# EAGLE design Spectroscilloscope Revised_7 (EAGLE 9.6.2)
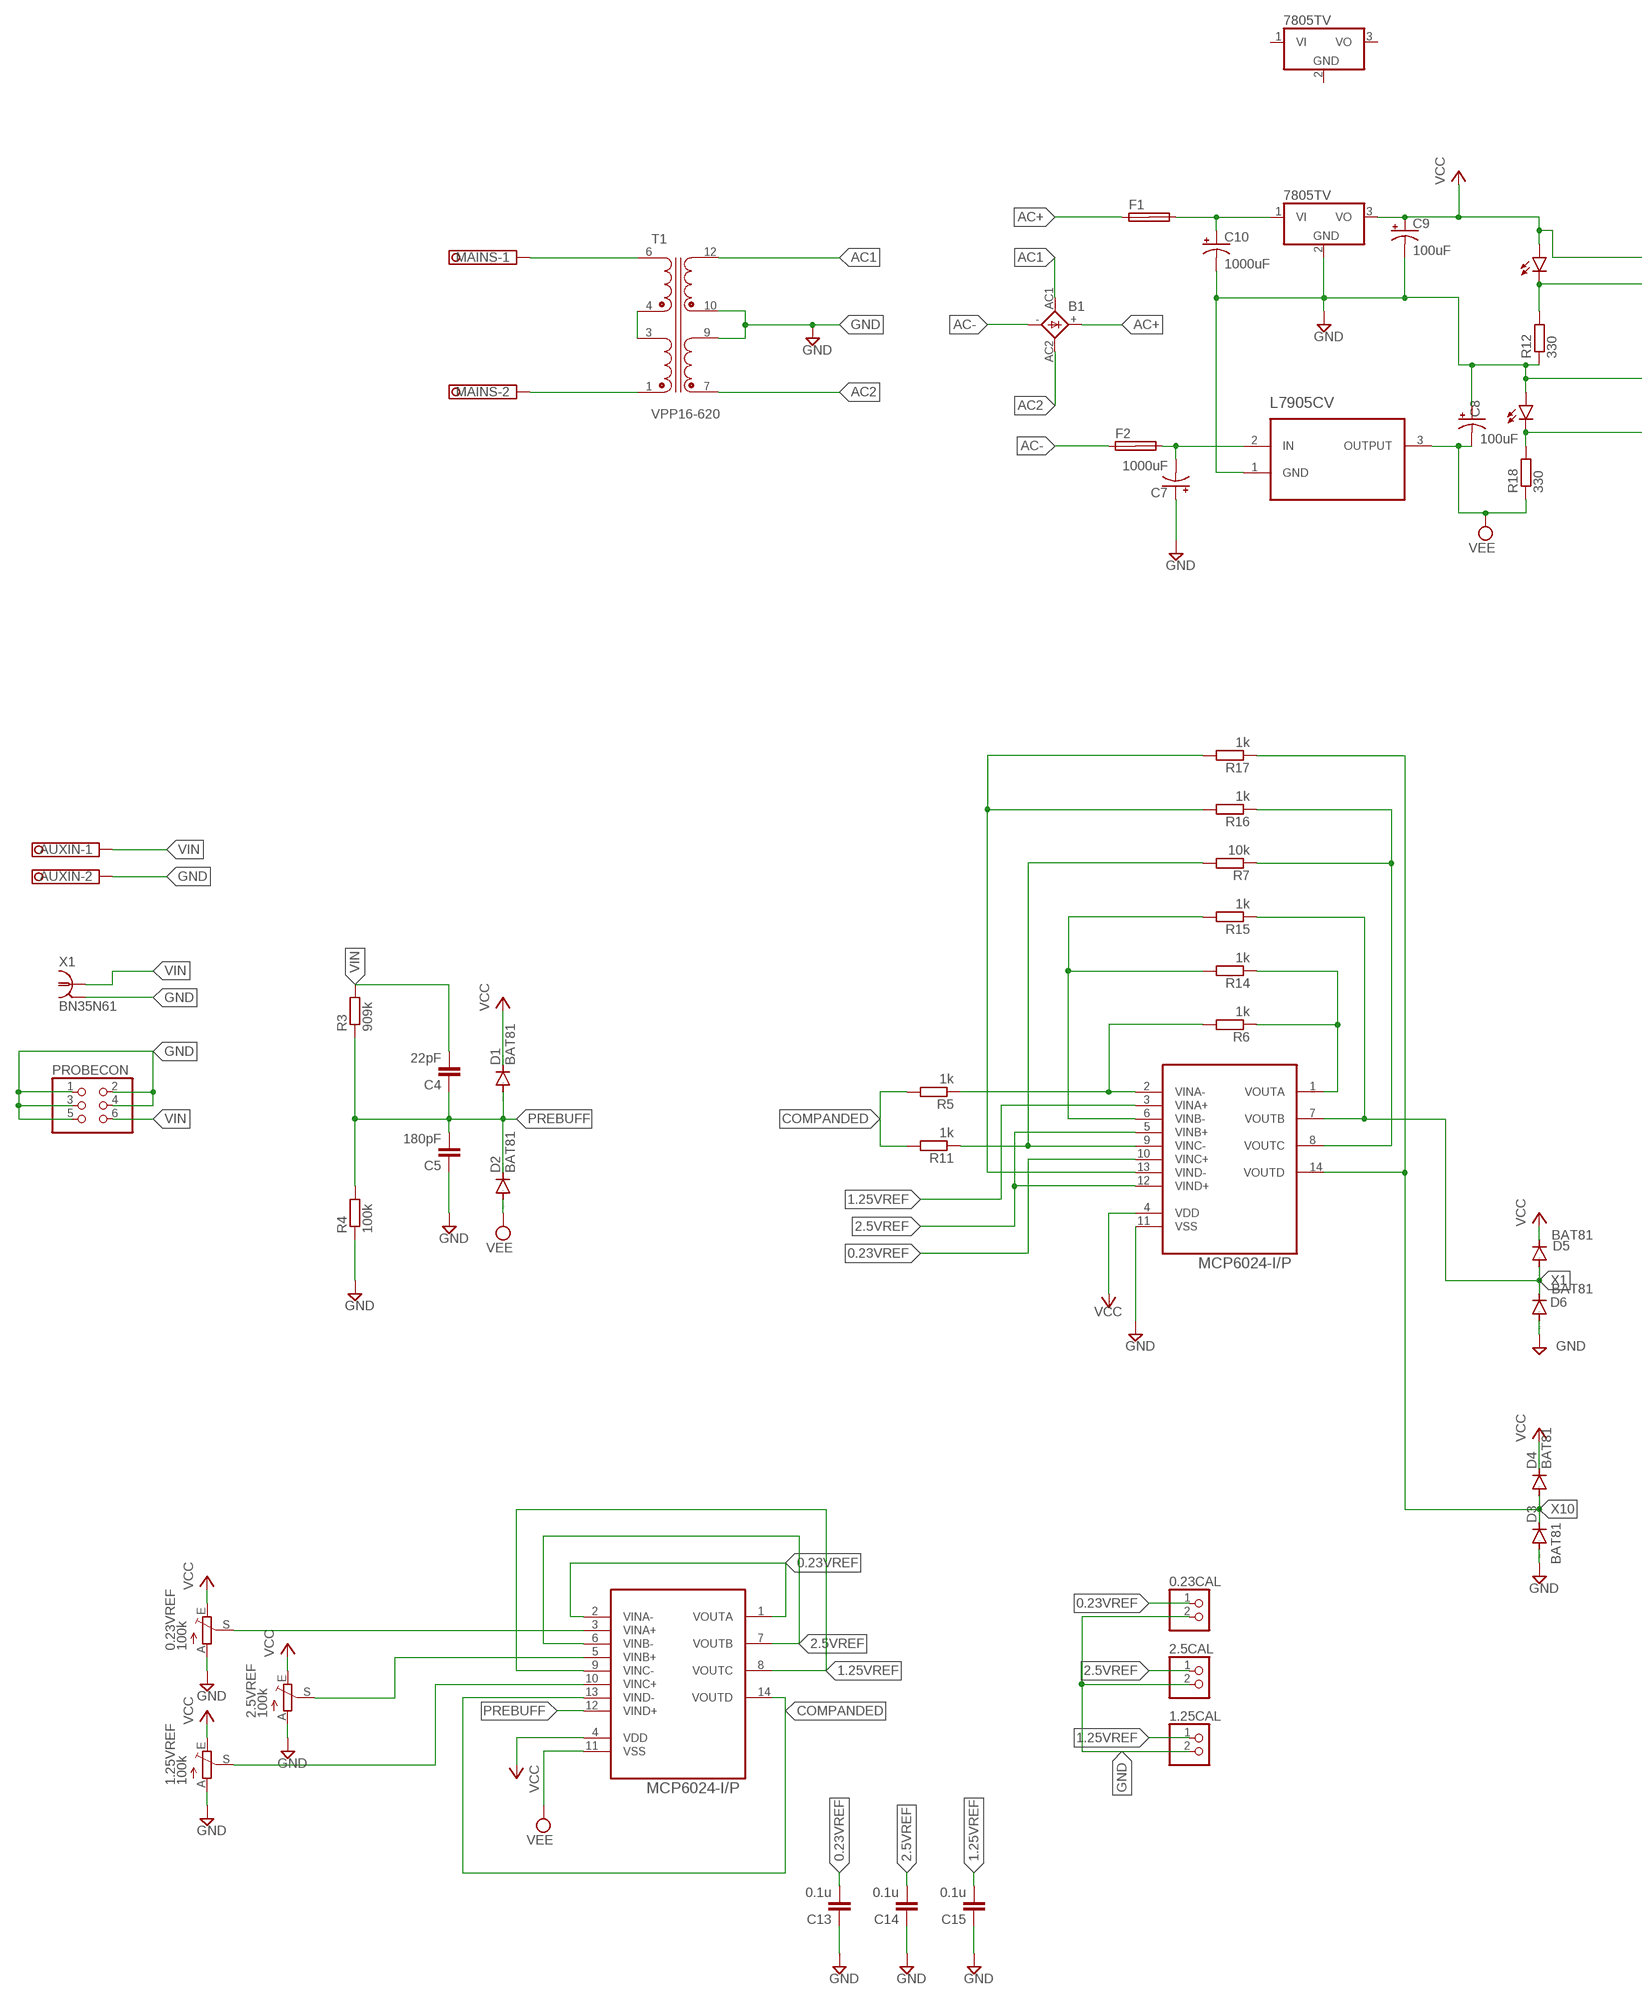
[diagram p0: schematic, sheet 1, part 1 of 2]
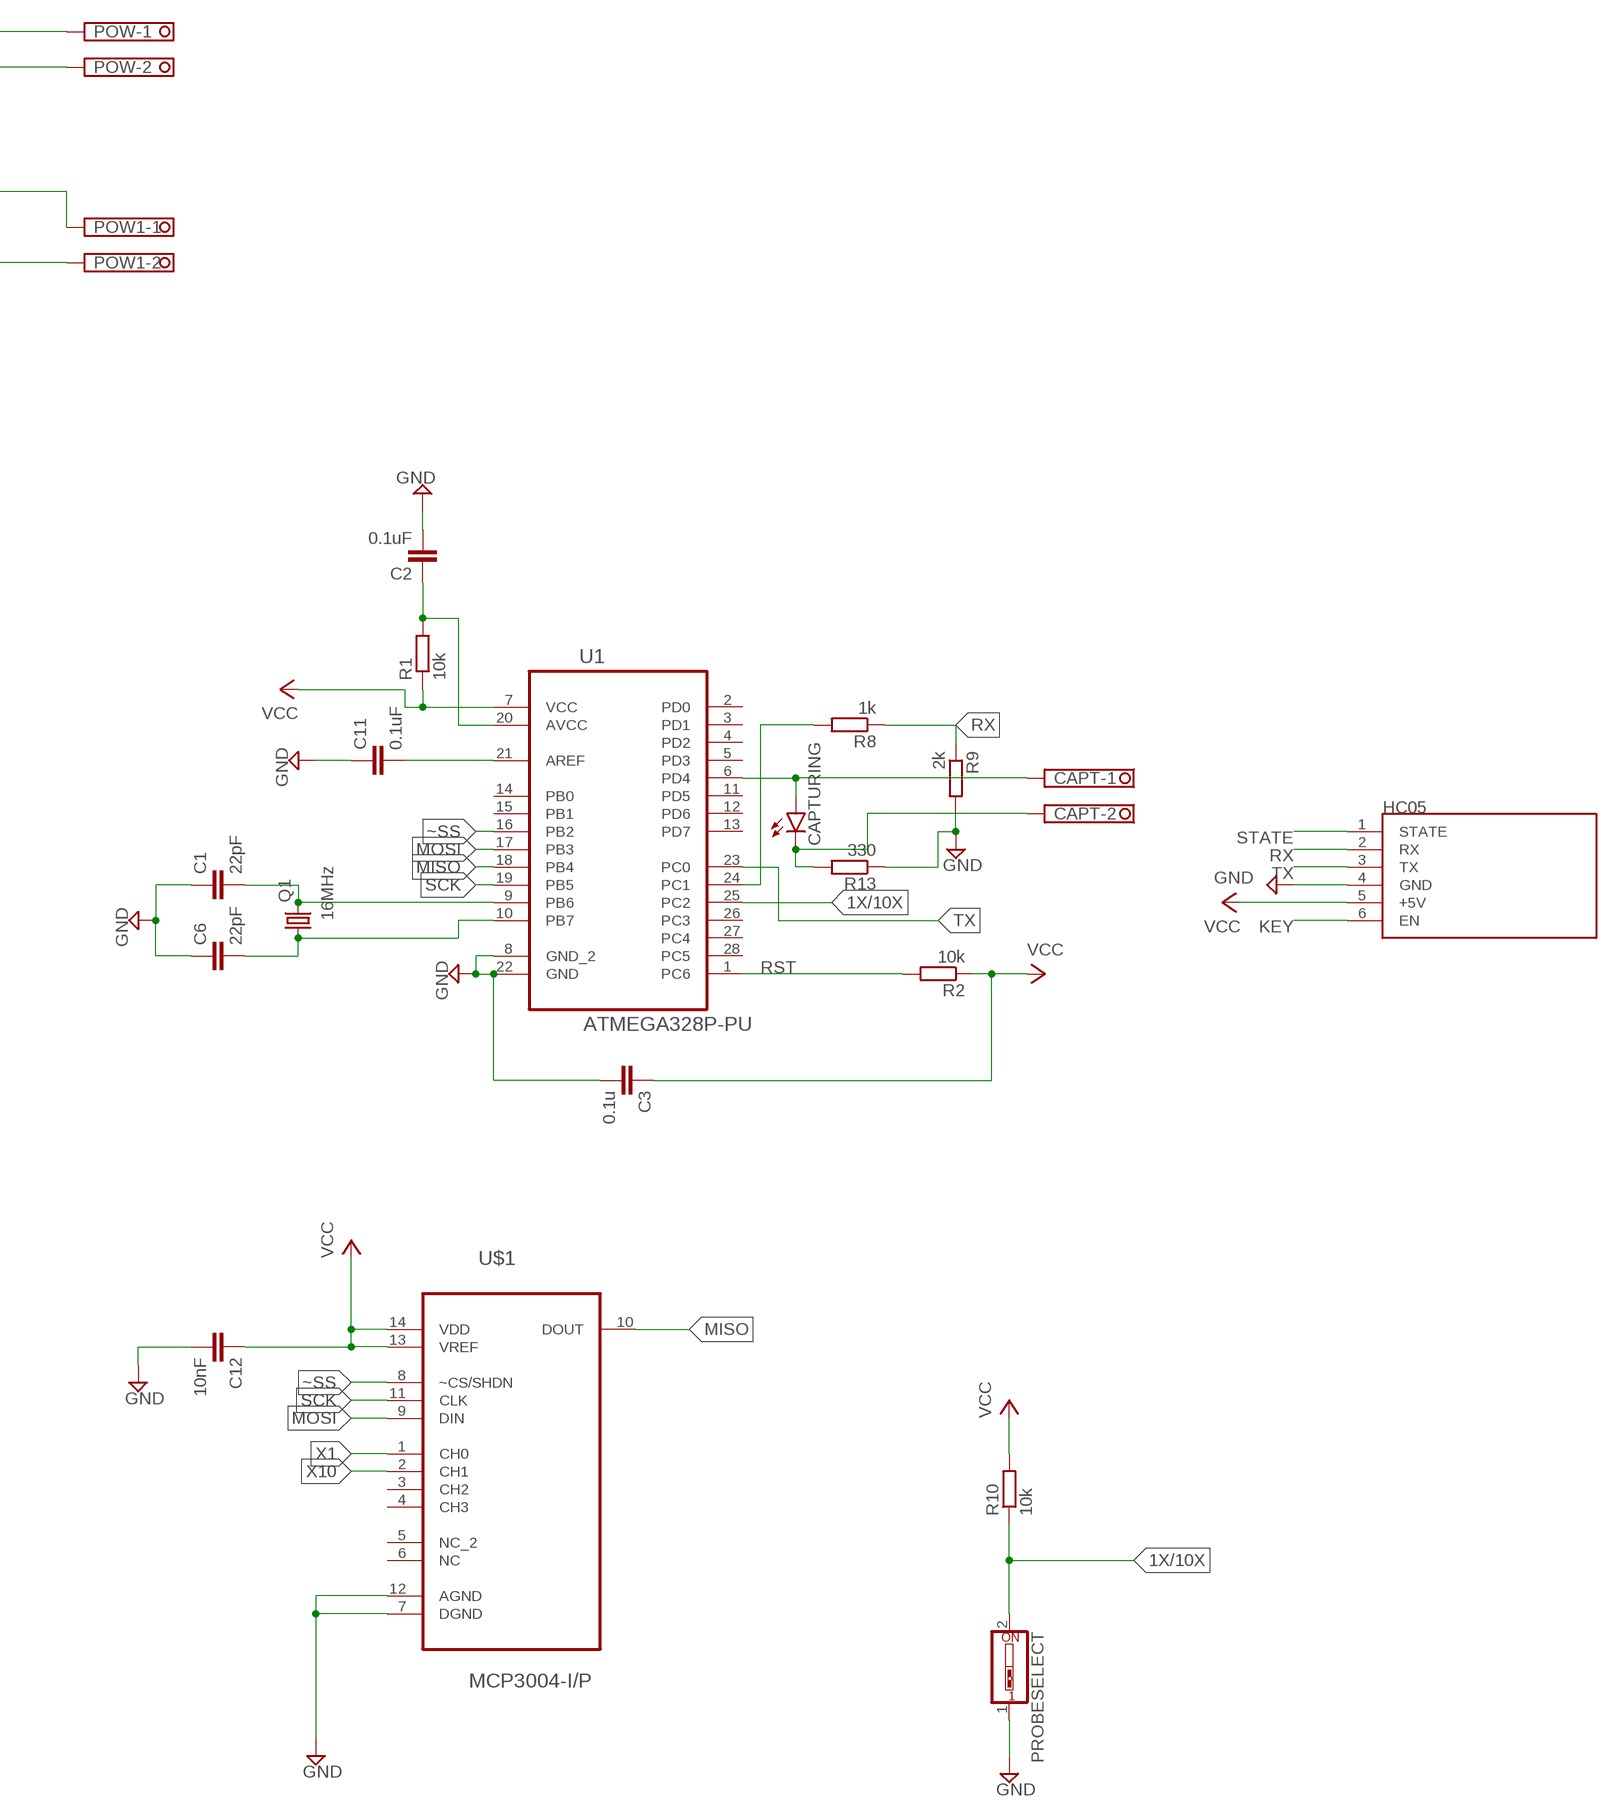
[diagram p1: schematic, sheet 1, part 2 of 2]

## Parts
0.23CAL  PINHD-1X2  [1X02]
0.23VREF  100k  TRIM_EU-B25P  [B25P]
1.25CAL  PINHD-1X2  [1X02]
1.25VREF  100k  TRIM_EU-B25P  [B25P]
2.5CAL  PINHD-1X2  [1X02]
2.5VREF  100k  TRIM_EU-B25P  [B25P]
AUXIN  TERMINAL-BLOCK-3.5MM-2-PIN-LONG-PAD  [TERMINAL-BLOCK-2-PIN-3.5MM-LONG-PAD]
B1  2KBP  [2KBP]
C1  22pF  C-EU050-024X044  [C050-024X044]
C2  0.1uF  C-EU050-024X044  [C050-024X044]
C3  0.1u  C-EU050-024X044  [C050-024X044]
C4  22pF  C-EU050-024X044  [C050-024X044]
C5  180pF  C-EU050-024X044  [C050-024X044]
C6  22pF  C-EU050-024X044  [C050-024X044]
C7  1000uF  CPOL-USE3.5-8  [E3,5-8]
C8  100uF  CPOL-USE2.5-5  [E2,5-5]
C9  100uF  CPOL-USE2.5-5  [E2,5-5]
C10  1000uF  CPOL-USE3.5-8  [E3,5-8]
C11  0.1uF  C-EU050-024X044  [C050-024X044]
C12  10nF  C-EU050-024X044  [C050-024X044]
C13  0.1u  C-EU050-024X044  [C050-024X044]
C14  0.1u  C-EU050-024X044  [C050-024X044]
C15  0.1u  C-EU050-024X044  [C050-024X044]
CAPT  TERMINAL-BLOCK-3.5MM-2-PIN-LONG-PAD  [TERMINAL-BLOCK-2-PIN-3.5MM-LONG-PAD]
CAPTURING  LED5MM  [LED5MM]
D1  BAT81  [DO34-7]
D2  BAT81  [DO34-7]
D3  BAT81  [DO34-7]
D4  BAT81  [DO34-7]
D5  BAT81  [DO34-7]
D6  BAT81  [DO34-7]
F1  SHK20L  [SHK20L]
F2  SHK20L  [SHK20L]
HC05  WIRELESS-BLUETOOTH-HC-05  [WIRELESS-BLUETOOTH-HC-05]
IC1  7805TV  [TO220V]
IC2  7805TV  [TO220V]
MAINS  TERMINAL-BLOCK-3.5MM-2-PIN-LONG-PAD  [TERMINAL-BLOCK-2-PIN-3.5MM-LONG-PAD]
POW  TERMINAL-BLOCK-3.5MM-2-PIN-LONG-PAD  [TERMINAL-BLOCK-2-PIN-3.5MM-LONG-PAD]
POW1  TERMINAL-BLOCK-3.5MM-2-PIN-LONG-PAD  [TERMINAL-BLOCK-2-PIN-3.5MM-LONG-PAD]
POWER  LED5MM  [LED5MM]
POWER1  LED5MM  [LED5MM]
PROBECON  PINHD-2X3  [2X03]
PROBESELECT  SW_DIP-1  [EDG-01]
Q1  16MHz  CRYSTALHC49U-V  [HC49U-V]
Q2  L7905CV  [TO254P450X1020X1935-3P]
R1  10k  R-EU_0204/7  [0204/7]
R2  10k  R-EU_0204/7  [0204/7]
R3  909k  R-EU_0204/7  [0204/7]
R4  100k  R-EU_0204/7  [0204/7]
R5  1k  R-EU_0204/7  [0204/7]
R6  1k  R-EU_0204/7  [0204/7]
R7  10k  R-EU_0204/7  [0204/7]
R8  1k  R-EU_0204/7  [0204/7]
R9  2k  R-EU_0204/7  [0204/7]
R10  10k  R-EU_0204/7  [0204/7]
R11  1k  R-EU_0204/7  [0204/7]
R12  330  R-EU_0204/7  [0204/7]
R13  330  R-EU_0204/7  [0204/7]
R14  1k  R-EU_0204/7  [0204/7]
R15  1k  R-EU_0204/7  [0204/7]
R16  1k  R-EU_0204/7  [0204/7]
R17  1k  R-EU_0204/7  [0204/7]
R18  330  R-EU_0204/7  [0204/7]
T1  VPP16-620  [XFMR_VPP16-620]
U1  ATMEGA328P-PU  [DIP254P762X457-28]
U2  MCP6024-I/P  [DIP254P762X533-14]
U3  MCP6024-I/P  [DIP254P762X533-14]
U$1  MCP3004-I/P  [DIP254P762X432-14]
X1  BN35N61  [B35N61]

## Nets
0.23VREF [Power Lines]: 0.23CAL.1 C13.2 U2.10(VINC+) U3.1(VOUTA) U3.2(VINA-)
1.25VREF [Power Lines]: 1.25CAL.1 C15.2 U2.3(VINA+) U3.8(VOUTC) U3.9(VINC-)
1X/10X: PROBESELECT.2 R10.1 U1.25(PC2)
2.5VREF [Power Lines]: 2.5CAL.1 C14.2 U2.5(VINB+) U2.12(VIND+) U3.6(VINB-) U3.7(VOUTB)
AC1 [Power Lines]: B1.AC1 T1.12
AC2 [Power Lines]: B1.AC2 T1.7
AC+ [Power Lines]: B1.+ F1.1A
AC- [Power Lines]: B1.- F2.1A
CAPTURING: CAPT.1 CAPTURING.A U1.6(PD4)
COMPANDED: R5.2 R11.2 U3.13(VIND-) U3.14(VOUTD)
GND [Power Lines]: 0.23CAL.2 0.23VREF.A 1.25CAL.2 1.25VREF.A 2.5CAL.2 2.5VREF.A AUXIN.2 C1.1 C2.2 C3.2 C5.1 C6.1 C7.+ C8.+ C9.- C10.- C11.1 C12.2 C13.1 C14.1 C15.1 D3.A D6.A HC05.4(GND) IC1.2(GND) POW1.1 POWER1.A PROBECON.1 PROBECON.2 PROBECON.3 PROBECON.4 PROBECON.5 PROBESELECT.1 Q2.1(GND) R4.1 R9.2 R12.1 R13.1 T1.9 T1.10 U1.8(GND_2) U1.22(GND) U2.11(VSS) U$1.7(DGND) U$1.12(AGND) X1.2 X1.3 X1.4 X1.5
KEY: HC05.6(EN)
MAINS1 [Power Lines]: MAINS.1 T1.6
MAINS2 [Power Lines]: MAINS.2 T1.1
MISO: U1.18(PB4) U$1.10(DOUT)
MOSI: U1.17(PB3) U$1.9(DIN)
N$1: C1.2 Q1.2 U1.9(PB6)
N$2: C6.2 Q1.1 U1.10(PB7)
N$3: 2.5VREF.S U3.5(VINB+)
N$4: R6.1 R14.1 U2.1(VOUTA)
N$5: R5.1 R6.2 U2.2(VINA-)
N$6: C11.2 U1.21(AREF)
N$7: 1.25VREF.S U3.10(VINC+)
N$8: C2.1 R1.2 U1.20(AVCC)
N$9: 0.23VREF.S U3.3(VINA+)
N$11 [Power Lines]: T1.3 T1.4
N$12: POW.2 POWER.K(C) R12.2
N$13: CAPT.2 CAPTURING.K(C) R13.2
N$15: R14.2 R15.2 U2.6(VINB-)
N$16: R7.2 R11.1 U2.9(VINC-)
N$17: R8.2 U1.24(PC1)
N$18: POW1.2 POWER1.K(C) R18.2
N$21: R16.2 R17.2 U2.13(VIND-)
N$22: R7.1 R16.1 U2.8(VOUTC)
NEG [Power Lines]: C7.- F2.2A Q2.2(IN)
POS [Power Lines]: C10.+ F1.2A IC1.1(VI)
PREBUFF: C4.1 C5.2 D1.A D2.C R3.1 R4.2 U3.12(VIND+)
RST: R2.2 U1.1(PC6)
RX: HC05.2(RX) R8.1 R9.1
SCK: U1.19(PB5) U$1.11(CLK)
STATE: HC05.1(STATE)
TX: HC05.3(TX) U1.23(PC0)
VCC [Power Lines]: 0.23VREF.E 1.25VREF.E 2.5VREF.E C3.1 C9.+ C12.1 D1.C D4.C D5.C HC05.5(+5V) IC1.3(VO) POW.1 POWER.A R1.1 R2.1 R10.2 U1.7(VCC) U2.4(VDD) U3.4(VDD) U$1.13(VREF) U$1.14(VDD)
VEE [Power Lines]: C8.- D2.A Q2.3(OUTPUT) R18.1 U3.11(VSS)
VIN: AUXIN.1 C4.2 PROBECON.6 R3.2 X1.1
X1: D5.A D6.C R15.1 U2.7(VOUTB) U$1.1(CH0)
X10: D3.C D4.A R17.1 U2.14(VOUTD) U$1.2(CH1)
~SS: U1.16(PB2) U$1.8(~CS/SHDN)
Unconnected: F1.1B F1.2B F2.1B F2.2B IC2.1(VI) IC2.2(GND) IC2.3(VO) U1.2(PD0) U1.3(PD1) U1.4(PD2) U1.5(PD3) U1.11(PD5) U1.12(PD6) U1.13(PD7) U1.14(PB0) U1.15(PB1) U1.26(PC3) U1.27(PC4) U1.28(PC5) U$1.3(CH2) U$1.4(CH3) U$1.5(NC_2) U$1.6(NC)

## Library data of the parts
0.23CAL 1.25CAL 2.5CAL = pinhead:PINHD-1X2: PIN HEADER
0.23VREF 1.25VREF 2.5VREF = pot:TRIM_EU-: POTENTIOMETER
AUXIN CAPT MAINS POW POW1 = Rembrandt Electronics - Terminal Block 3-5mm v1-0:TERMINAL-BLOCK-3.5MM-2-PIN: Terminal Block 3.5mm Pitch: 3,5 mm Number of pins: 2 Created by Rembrandt Electronics www.rembrandtelectronics.com
B1 = rectifier:2KBP: RECTIFIER grid 3 x 3,81 mm
C1-C6 C11-C15 = rcl:C-EU: CAPACITOR, European symbol; SPICEPREFIX: C
C7-C10 = rcl:CPOL-US: POLARIZED CAPACITOR, American symbol; SPICEPREFIX: C
CAPTURING POWER POWER1 = led:LED: LED OSRAM: - CHIPLED LG R971, LG N971, LY N971, LG Q971, LY Q971, LO R971, LY R971 LH N974, LH R974 LS Q976, LO Q976, LY Q976 LO Q996 - Hyper CHIPLED LW Q18S LB Q993, LB Q99A, LB R99A - SideLED LS A670, LO A670, LY A670, LG A670, LP A670 LB A673, LV A673, LT A673, LW A673 LH A674 LY A675 LS A676, LA A676, LO A676, LY A676, LW A676 LS A679, LY A679, LG A679 - Hyper Micro SIDELED® LS Y876, LA Y876, LO Y876, LY Y876 LT Y87S - SmartLED LW L88C, LW L88S LB L89C, LB L89S, LG L890 LS L89K, LO L89K, LY L89K LS L896, LA L896, LO L896, LY L896 - TOPLED LS T670, LO T670, LY T670, LG T670, LP T670 LSG T670, LSP T670, LSY T670, LOP T670, LYG T670 LG T671, LOG T671, LSG T671 LB T673, LV T673, LT T673, LW T673 LH T674 LS T676, LA T676, LO T676, LY T676, LB T676, LH T676, LSB T676, LW T676 LB T67C, LV T67C, LT T67C, LS T67K, LO T67K, LY T67K, LW E67C LS E67B, LA E67B, LO E67B, LY E67B, LB E67C, LV E67C, LT E67C LW T67C LS T679, LY T679, LG T679 LS T770, LO T770, LY T770, LG T770, LP T770 LB T773, LV T773, LT T773, LW T773 LH T774 LS E675, LA E675, LY E675, LS T675 LS T776, LA T776, LO T776, LY T776, LB T776 LHGB T686 LT T68C, LB T68C - Hyper Mini TOPLED® LB M676 - Mini TOPLED Santana® LG M470 LS M47K, LO M47K, LY M47K Source: http://www.osram.convergy.de LUXEON: - LUMILED® LXK2-PW12-R00, LXK2-PW12-S00, LXK2-PW14-U00, LXK2-PW14-V00 LXK2-PM12-R00, LXK2-PM12-S00, LXK2-PM14-U00 LXK2-PE12-Q00, LXK2-PE12-R00, LXK2-PE12-S00, LXK2-PE14-T00, LXK2-PE14-U00 LXK2-PB12-K00, LXK2-PB12-L00, LXK2-PB12-M00, LXK2-PB14-N00, LXK2-PB14-P00, LXK2-PB14-Q00 LXK2-PR12-L00, LXK2-PR12-M00, LXK2-PR14-Q00, LXK2-PR14-R00 LXK2-PD12-Q00, LXK2-PD12-R00, LXK2-PD12-S00 LXK2-PH12-R00, LXK2-PH12-S00 LXK2-PL12-P00, LXK2-PL12-Q00, LXK2-PL12-R00 Source: www.luxeon.com KINGBRIGHT: KA-3528ASYC Source: www.kingbright.com
D1-D6 = diode:BAT81: DIODE barrier diode
F1 F2 = fuse:SHK20L: FUSE HOLDER 5 x 20 mm, SH contact, SHH1 Schukat, E1073 Buerklin; OC_FARNELL: unknown; OC_NEWARK: unknown
HC05 = diy-modules:WIRELESS-BLUETOOTH-HC-05: Bluetooth Transceiver Module based on HC-05 board Tutorial is available here: https://arduino-info.wikispaces.com/BlueTooth-HC05-HC06-Modules-How-To Click here to find device on ebay.com <http://www.ebay.com/sch/hc-05+module+rs232>
IC1 IC2 = linear:78*: Positive VOLTAGE REGULATOR Source: http://cache.national.com/ds/LM/LM78L05.pdf http://www.fairchildsemi.com/ds/LM/LM7805.pdf
PROBECON = pinhead:PINHD-2X3: PIN HEADER
PROBESELECT = special:SW_DIP-1: DIP SWITCH
Q1 = crystal:CRYSTAL: CRYSTAL; OC_FARNELL: 1666969; OC_NEWARK: unknown
Q2 = L7905CV:L7905CV: 2 % negative voltage regulators Check prices <https://pricing.snapeda.com/parts/L7905CV/STMicroelectronics/view-part?ref=eda>; AVAILABILITY: In Stock; DESCRIPTION: Linear Voltage Regulator IC Negative Fixed 1 Output 1.5A TO-220; MF: STMicroelectronics; MP: L7905CV; PACKAGE: TO-220-3 ON Semiconductor; PRICE: None
R1-R18 = rcl:R-EU_: RESISTOR, European symbol; SPICEPREFIX: R
T1 = VPP16-620:VPP16-620: Power Transformer 4000Vrms Dual Prim. Dual Sec. 230V/115V Prim. 16V/8V Sec. Through Hole Check prices <https://pricing.snapeda.com/parts/VPP16-620/Triad%20Magnetics/view-part?ref=eda>; AVAILABILITY: In Stock; DESCRIPTION: Power Transformer 4000Vrms Dual Prim. Dual Sec. 230V/115V Prim. 16V/8V Sec. Through Hole; MF: Triad Magnetics; MP: VPP16-620; PACKAGE: Triad Magnetics; PRICE: None
U1 = ATMEGA328P-PU:ATMEGA328P-PU: 8-bit Microcontroller with In-System Programmable Flash Buy Part <https://snapeda.com/parts/ATMEGA328P-PU/Microchip/view-part/?ref=eda>; AVAILABILITY: Good; DESCRIPTION: AVR AVR® ATmega Microcontroller IC 8-Bit 20MHz 32KB (16K x 16) FLASH 28-PDIP; DIGIKEY-PURCHASE-URL: https://snapeda.com/shop?store=DigiKey&id=2895131; MF: Microchip; MOUSER-PURCHASE-URL: https://snapeda.com/shop?store=Mouser&id=2895131; MP: ATMEGA328P-PU; PACKAGE: DIP-28 Generic; PRICE: None
U2 U3 = MCP6024-I_P:MCP6024-I/P: IC OPAMP 2.5V QUAD R-R Check prices <https://pricing.snapeda.com/parts/MCP6024-I/P/Microchip%20Technology/view-part?ref=eda>; AVAILABILITY: Warning; DESCRIPTION: IC OPAMP GP 4 CIRCUIT 14DIP; MF: Microchip Technology; MP: MCP6024-I/P; PACKAGE: None; PRICE: None; PURCHASE-URL: https://pricing.snapeda.com/search/part/MCP6024-I/P/?ref=eda
U$1 = MCP3004-I_P:MCP3004-I/P: A/D Converters; AVAILABILITY: Unavailable; DESCRIPTION: 10 Bit Analog to Digital Converter 2, 4 Input 1 SAR 14-PDIP; MF: Microchip; MP: MCP3004-I/P; PACKAGE: DIP-14 Microchip; PRICE: None
X1 = con-coax:BN35N61: BNC CONNECTOR M/A COM www.macom.com distributor Farnell 149-452; OC_FARNELL: unknown; OC_NEWARK: unknown

## Net classes
0 default: width 0.406 mm, clearance 0.203 mm
1 Power Lines: width 0.762 mm, clearance 0.203 mm

## Board
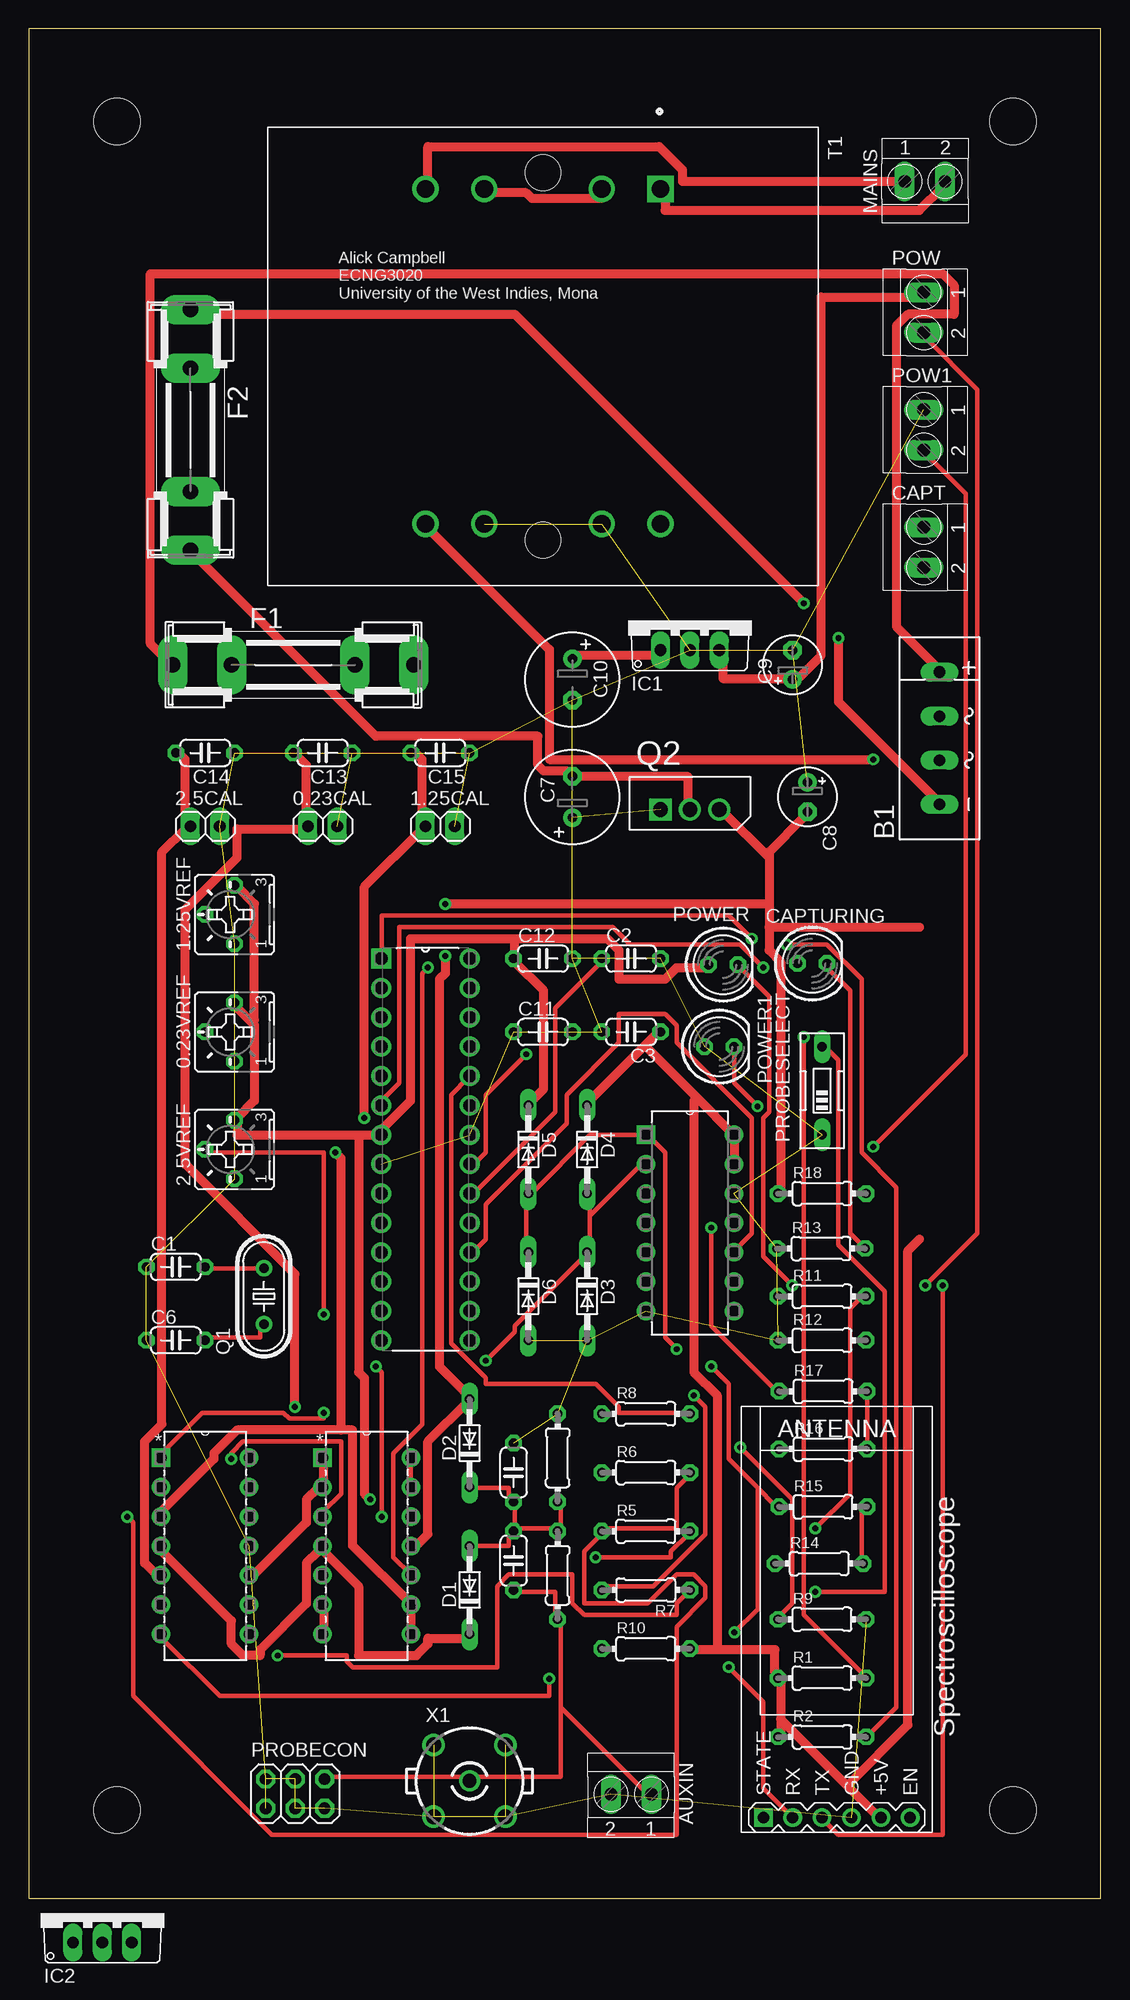
[diagram p2: board, top side]
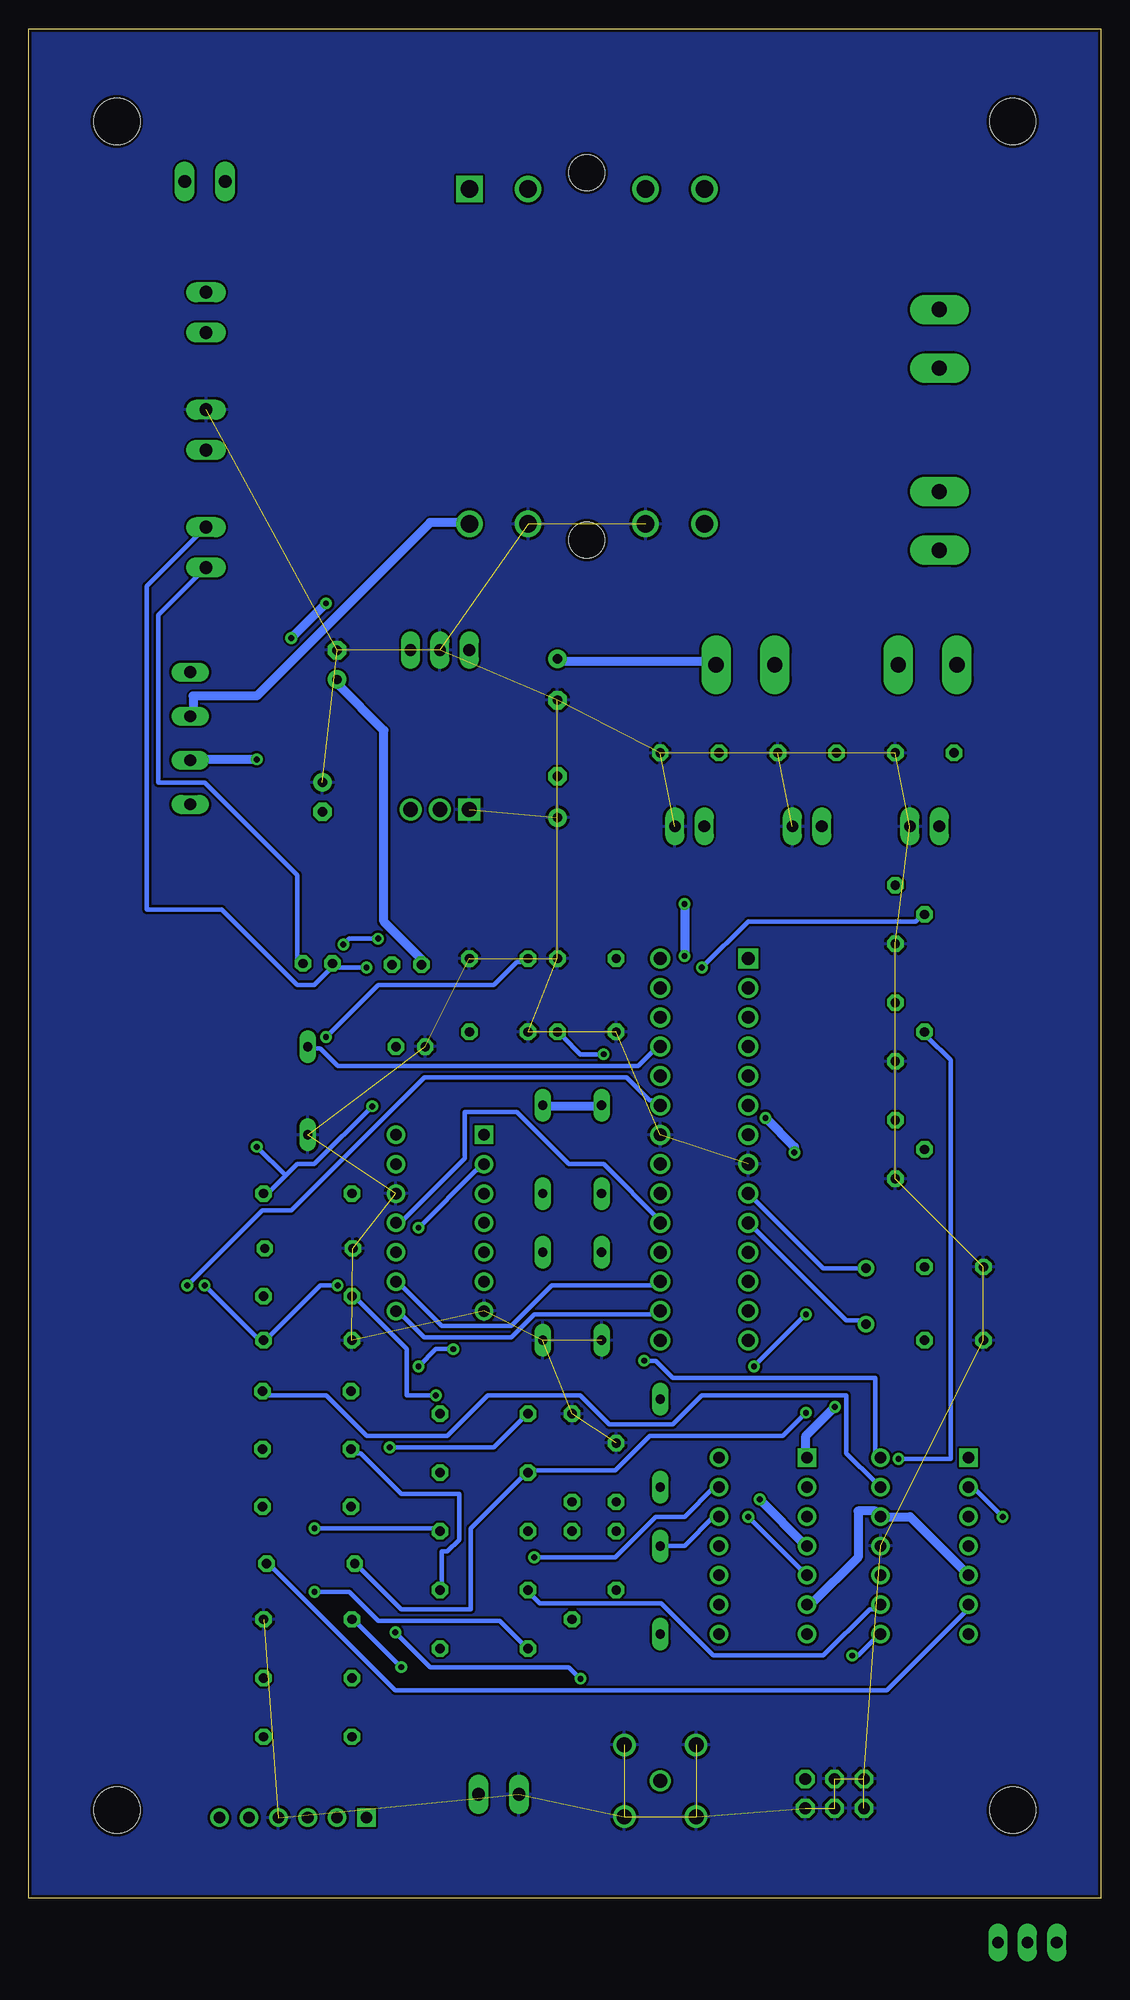
[diagram p3: board, bottom side, seen from below]

Size 92.69 x 161.68 mm. Coordinates in mm from the lower left corner, seen from the top.
Outline: 0,0 92.69,0 92.69,161.68 0,161.68 0,0
Copper layers (1*16): Top 0.035mm / dielectric 1.5mm / Bottom 0.035mm
Design rules "ENGR1200_Design_Rules": minimum track width 8mil, minimum drill 20mil, track to track 8mil, track to pad 8mil, pad to pad 8mil, via to via 8mil, smd to smd 8mil, copper to edge 10mil, drill to drill 8mil, minimum pad ring 12mil, minimum via ring 10mil, stop-mask expansion 4mil, vias tented up to drill 25mil, thermal gap 10mil
Holes 4 mm at 7.62,7.62 85.09,7.62 85.09,153.67 7.62,153.67

### Footprints (pad centres in the part's own frame; a part is rotated, then mirrored left to right if it is on the bottom)
1X02 = drill 1.016 long: 1 -1.27,0; 2 1.27,0
B25P = drill 0.813 octagon: A -2.54,0; E 2.54,0; S 0,2.54
TERMINAL-BLOCK-2-PIN-3.5MM-LONG-PAD = drill 1.1 pad 1.7 long: 1 -1.75,-0.1; 2 1.75,-0.1
2KBP = drill 1.016 long: + 5.715,0; - -5.715,0; AC1 -1.905,0; AC2 1.905,0
C050-024X044 = drill 0.813 octagon: 1 -2.54,0; 2 2.54,0
E3,5-8 = drill 0.813 pad 1.6: + -1.778,0 | drill 0.813 pad 1.6 octagon: - 1.778,0
E2,5-5 = drill 0.813 pad 1.6: + -1.27,0 | drill 0.813 pad 1.6 octagon: - 1.27,0
LED5MM = drill 0.813 octagon: A -1.27,0; K 1.27,0
DO34-7 = drill 0.813 long: A 3.81,0; C -3.81,0
SHK20L = drill 1.321 pad 2.54 long: 1A -10.414,0; 1B -5.334,0; 2A 10.414,0; 2B 5.334,0
WIRELESS-BLUETOOTH-HC-05 = drill 1 square: 1 -6.35,-17.145 | drill 1: 2 -3.81,-17.145; 3 -1.27,-17.145; 4 1.27,-17.145; 5 3.81,-17.145; 6 6.35,-17.145
TO220V = drill 1.016 long: 1 -2.54,-2.54; 2 0,-2.54; 3 2.54,-2.54
2X03 = drill 1.016 octagon: 1 -2.54,-1.27; 2 -2.54,1.27; 3 0,-1.27; 4 0,1.27; 5 2.54,-1.27; 6 2.54,1.27
EDG-01 = drill 0.813 long: 1 0,-3.81; 2 0,3.81
HC49U-V = drill 0.813: 1 -2.413,0; 2 2.413,0
TO254P450X1020X1935-3P = drill 1.27 square: 1 -5.08,-1.092 | drill 1.27: 2 -2.54,-1.092; 3 0,-1.092
0204/7 = drill 0.813 octagon: 1 -3.81,0; 2 3.81,0
XFMR_VPP16-620 = drill 1.524 square: 1 -14.478,10.16 | drill 1.524: 3 -14.478,5.08; 4 -14.478,-5.08; 6 -14.478,-10.16; 7 14.478,10.16; 9 14.478,5.08; 10 14.478,-5.08; 12 14.478,-10.16 | hole 3.099: -15.875,0; 15.875,0
DIP254P762X457-28 = drill 1.118 square: 1 -7.62,33.02 | drill 1.118: 2 -7.62,30.48; 3 -7.62,27.94; 4 -7.62,25.4; 5 -7.62,22.86; 6 -7.62,20.32; 7 -7.62,17.78; 8 -7.62,15.24; 9 -7.62,12.7; 10 -7.62,10.16; 11 -7.62,7.62; 12 -7.62,5.08; 13 -7.62,2.54; 14 -7.62,0; 15 0,0; 16 0,2.54; 17 0,5.08; 18 0,7.62; 19 0,10.16; 20 0,12.7; 21 0,15.24; 22 0,17.78; 23 0,20.32; 24 0,22.86; 25 0,25.4; 26 0,27.94; 27 0,30.48; 28 0,33.02
DIP254P762X533-14 = drill 0.991 square: 1 -7.62,15.24 | drill 0.991: 2 -7.62,12.7; 3 -7.62,10.16; 4 -7.62,7.62; 5 -7.62,5.08; 6 -7.62,2.54; 7 -7.62,0; 8 0,0; 9 0,2.54; 10 0,5.08; 11 0,7.62; 12 0,10.16; 13 0,12.7; 14 0,15.24
DIP254P762X432-14 = drill 0.991 square: 1 -7.62,15.24 | drill 0.991: 2 -7.62,12.7; 3 -7.62,10.16; 4 -7.62,7.62; 5 -7.62,5.08; 6 -7.62,2.54; 7 -7.62,0; 8 0,0; 9 0,2.54; 10 0,5.08; 11 0,7.62; 12 0,10.16; 13 0,12.7; 14 0,15.24
B35N61 = drill 1.2: 1 0,0 | drill 1.3: 2 3.099,3.099; 3 -3.099,3.099; 4 -3.099,-3.099; 5 3.099,-3.099

### Placement (x,y rotation side)
0.23CAL  25.4,92.71 0 top
0.23VREF  17.78,74.93 90 top
1.25CAL  35.56,92.71 0 top
1.25VREF  17.78,85.09 90 top
2.5CAL  15.24,92.71 0 top
2.5VREF  17.78,64.77 90 top
AUXIN  52.07,8.89 180 top
B1  78.74,100.33 90 top
C1  12.7,54.61 0 top
C2  52.07,81.28 0 top
C3  52.07,74.93 180 top
C4  41.91,29.21 270 top
C5  41.91,36.83 270 top
C6  12.7,48.26 0 top
C7  46.99,95.25 90 top
C8  67.31,95.25 270 top
C9  66.04,106.68 90 top
C10  46.99,105.41 270 top
C11  44.45,74.93 0 top
C12  44.45,81.28 0 top
C13  25.4,99.06 180 top
C14  15.24,99.06 180 top
C15  35.56,99.06 180 top
CAPT  77.47,116.84 270 top
CAPTURING  67.73,80.85 0 top
D1  38.1,26.67 90 top
D2  38.1,39.37 90 top
D3  48.26,52.07 270 top
D4  48.26,64.77 270 top
D5  43.18,64.77 270 top
D6  43.18,52.07 270 top
F1  22.86,106.68 0 top
F2  13.97,127 270 top
HC05  69.85,24.13 0 top
IC1  57.15,110.49 0 top
IC2  6.35,-1.27 0 top  (outside the outline)
MAINS  77.47,148.59 0 top
POW  77.47,137.16 270 top
POW1  77.47,127 270 top
POWER  60.02,80.75 0 top
POWER1  59.69,73.66 0 top
PROBECON  23.03,9.05 0 top
PROBESELECT  68.58,69.85 0 top
Q1  20.32,52.07 90 top
Q2  59.69,95.25 0 top
R1  68.58,19.05 0 top
R2  68.58,13.97 0 top
R3  45.72,27.94 270 top
R4  45.72,38.1 270 top
R5  53.34,31.75 0 top
R6  53.34,36.83 0 top
R7  53.34,26.67 180 top
R8  53.34,41.91 0 top
R9  68.58,24.13 0 top
R10  53.34,21.59 0 top
R11  68.58,52.07 0 top
R12  68.58,48.26 0 top
R13  68.49,56.21 0 top
R14  68.33,28.96 0 top
R15  68.67,33.86 0 top
R16  68.67,38.86 0 top
R17  68.67,43.86 0 top
R18  68.58,60.96 0 top
T1  44.45,133.35 270 top
U1  38.1,48.26 0 top
U2  19.05,22.86 0 top
U3  33.02,22.86 0 top
U$1  60.96,50.8 0 top
X1  38.1,10.16 0 top

### Tracks (layer width: path | path; a pad name or v marks a point on that pad's centre or on a via)
0.23VREF  (via drill 0.51)
  Top 0.762: C13.2 23,99 24,98 24,93 0.23CAL.1 24,92.5 18,92.5 18,90 13.5,85.5 13.5,63.5 23,54 v23,42.5 | U2.10 19.5,28 24,32.5 24,34.5 25,35.5 U3.2 25.5,36 25.5,38 U3.1
  Bottom 0.762: v23,42.5 25.5,40 25.5,38.5 U3.1
1.25VREF  (via drill 0.51)
  Top 0.762: C15.2 33.5,99 34,98.5 34,93 1.25CAL.1 34,92.5 29,87.5 v29,67.5 | 27,40.5 28,40.5 28,30.5 33,25.5 U3.9 33,25 33,23 U3.8 | 27,40.5 18,40.5 16,38.5 16,38 11.5,33.5 U2.3 | v26.5,64.5 27,64 27,40.5
  Bottom 0.762: v29,67.5 26.5,65 v26.5,64.5
1X/10X  (via drill 0.51)
  Top 0.406: v68,26.5 74,26.5 74,52.5 70,56.5 70,72.5 69,73.5 PROBESELECT.2
  Bottom 0.406: v68,26.5 65,26.5 62.5,24 52,24 50,22 R10.1 | U1.25 38.5,73.5 40,72 66,72 67.5,73.5 68.5,73.5 PROBESELECT.2
2.5VREF
  Top 0.762: C14.2 13,99 13.5,98.5 13.5,93 2.5CAL.1 13.5,92.5 11.5,90.5 11.5,41 10,39.5 10,29 11,28 U2.5 | U3.7 25.5,23 25.5,25 U3.6
  Bottom 0.762: U2.5 11.5,28 16.5,33 19,33 U2.12 19.5,33.5 21,33.5 21,29.5 25,25.5 U3.6
AC1  (via drill 0.51)
  Top 0.762: v73,98.5 45,98.5 45,108 34.5,118.5 T1.12
  Bottom 0.762: v73,98.5 78.5,98.5 B1.AC1
AC2
  Bottom 0.762: B1.AC2 78.5,102.5 78.5,104 73,104 58,119 55,119 T1.7
AC+
  Top 0.762: B1.+ 78.5,106.5 75,110 75,136 76,137 80,137 80,139.5 79,140.5 10.5,140.5 10.5,108.5 12,107 F1.1A
AC-  (via drill 0.51)
  Top 0.762: v70,109 70,103.5 78.5,95 B1.- | v67,112 42,137 14,137 F2.1A
  Bottom 0.762: v67,112 v70,109
CAPTURING  (via drill 0.51)
  Top 0.406: v63.5,80.5 61.5,82.5 52,82.5 50.5,84 32,84 32,70.5 30.5,69 U1.6
  Bottom 0.406: v63.5,80.5 66,80.5 CAPTURING.A 66.5,80.5 68,79 69.5,79 76,85.5 82.5,85.5 82.5,113.5 77.5,118.5 CAPT.1
COMPANDED  (via drill 0.51)
  Top 0.406: U3.13 33,36 33,38 U3.14 | v68,32 71,35 71,51 72,52 R11.2 | v49,29.5 55.5,29.5 55.5,30 57,31.5 R5.2
  Bottom 0.406: v68,32 57.5,32 R5.2 | v49,29.5 42,29.5 38.5,33 36,33 33.5,35.5 U3.13
GND  (48 unrouted)
  pour Bottom: 0,0 92.71,0 92.71,161.67 92.58,161.8 0.13,161.8 0,161.67
MAINS1
  Top 0.762: MAINS.1 75.5,148.5 56.5,148.5 56.5,149.5 54.5,151.5 34.5,151.5 34.5,148 T1.6
MAINS2
  Top 0.762: MAINS.2 79,148 77,146 55,146 55,147.5 T1.1
MISO
  Top 0.406: U$1.10 61,56 62.5,57.5 62.5,67.5 56,74 56,75.5 55,76.5 51,76.5 51,74 46.5,69.5 46.5,67 39.5,60 39.5,57 38.5,56 U1.18
MOSI
  Bottom 0.406: U$1.9 60.5,53 57,49.5 51,49.5 47.5,53 38.5,53 U1.17
N$1
  Top 0.406: Q1.2 20,54.5 15.5,54.5 C1.2
  Bottom 0.406: U1.9 30,60.5 24,54.5 20.5,54.5 Q1.2
N$2
  Top 0.406: C6.2 15.5,48.5 20,48.5 20,49.5 Q1.1
  Bottom 0.406: U1.10 30,58 22,50 20.5,50 Q1.1
N$3  (via drill 0.51)
  Top 0.406: v25.5,50.5 25.5,64.5 15.5,64.5 2.5VREF.S | v30,46 30.5,45.5 v30.5,33
  Bottom 0.406: v30,46 v25.5,50.5 | v30.5,33 26,28.5 25.5,28.5 25,28 U3.5
N$4  (via drill 0.51)
  Top 0.406: v25.5,42 25.5,41.5 22.5,41.5 22,42 15,42 11.5,38.5 U2.1
  Bottom 0.406: R14.1 64.5,28.5 64,28.5 60.5,25 54.5,25 54.5,32 50,36.5 R6.1 49.5,37 42,37 39,40 27.5,40 v25.5,42
N$5  (via drill 0.51)
  Top 0.406: R6.2 57,36.5 56,35.5 56,32 50,32 R5.1 49.5,31.5 48,30 48,25.5 53.5,25.5 56,28 57.5,28 58.5,27 58.5,26 56,23.5 56,5.5 21,5.5 9,17.5 9,32.5 v8.5,33
  Bottom 0.406: v8.5,33 11,35.5 U2.2
N$6  (via drill 0.51)
  Top 0.406: v43,73 39.5,69.5 39.5,64.5 38.5,63.5 U1.21
  Bottom 0.406: v43,73 45,73 46.5,74.5 C11.2
N$7  (via drill 0.51)
  Top 0.406: v34.5,80.5 34,80 34,41 31.5,38.5 31.5,29.5 33,28 U3.10
  Bottom 0.406: v34.5,80.5 30.5,84.5 16,84.5 15.5,85 1.25VREF.S
N$8  (via drill 0.51)
  Top 0.406: v67,74.5 67,24.5 72,19.5 R1.2 | U1.20 38.5,61 45.5,68 45.5,77 49.5,81 C2.1
  Bottom 0.406: v67,74.5 62.5,79 52.5,79 50.5,81 50,81 C2.1
N$9  (via drill 0.51)
  Top 0.406: v17.5,38 17.5,38.5 18.5,39.5 27,39.5 27,35 25.5,33.5 U3.3
  Bottom 0.406: v17.5,38 13,38 13,72.5 15,74.5 0.23VREF.S
N$11
  Top 0.762: T1.4 39.5,147.5 43,147.5 43.5,147 49.5,147 49.5,147.5 T1.3
N$12  (via drill 0.51)
  Top 0.406: v66,53 63.5,55.5 63.5,67.5 64,68 64,78 61.5,80.5 POWER.K | v77.5,53 82,57.5 82,130.5 77.5,135 POW.2
  Bottom 0.406: v66,53 67.5,53 72,48.5 R12.2 72.5,48.5 73,48.5 v77.5,53
N$13
  Top 0.406: R13.2 72,56.5 71,57.5 71,78.5 69,80.5 CAPTURING.K
  Bottom 0.406: CAPT.2 77.5,115 81.5,111 81.5,96.5 77.5,96.5 69.5,88.5 69.5,81 69,81 CAPTURING.K
N$15
  Top 0.406: R14.2 72,29 72,33.5 R15.2
  Bottom 0.406: U2.6 11.5,25 18.5,18 61,18 71.5,28.5 72,28.5 R14.2
N$16  (via drill 0.51)
  Top 0.406: v57.5,43.5 58.5,42.5 58.5,31.5 54,27 50,27 R7.2
  Bottom 0.406: R7.2 49.5,26.5 48.5,25.5 38,25.5 33.5,21 24,21 20,25 19.5,25 U2.9 | v57.5,43.5 60,43.5 60,47.5 64.5,52 R11.1
N$17
  Top 0.406: R8.2 57,42 51,42 51,42.5 49,44.5 39.5,44.5 39.5,45 36.5,48 36.5,69.5 38,71 U1.24
N$18  (via drill 0.51)
  Top 0.406: v63,68.5 61,70.5 61,73.5 POWER1.K | v73,65 81,73 81,121.5 77.5,125 POW1.2
  Bottom 0.406: 70.5,62.5 69.5,63.5 68,63.5 v63,68.5 | 70.5,62.5 72,61 R18.2 | 70.5,62.5 v73,65
N$21
  Top 0.406: R16.2 72.5,39 72.5,43.5 R17.2
  Bottom 0.406: U2.13 19.5,36 22,38.5 22,43.5 34.5,43.5 37,41 42.5,41 45,43.5 53,43.5 56.5,40 63.5,40 67,43.5 72,43.5 R17.2
N$22  (via drill 0.51)
  Top 0.406: v21.5,21 27.5,21 27.5,20.5 28,20 40.5,20 40.5,27 41.5,28 47,28 47,25.5 48,24.5 56,24.5 56,25.5 57,26.5 R7.1
  Bottom 0.406: R7.1 57,27 57,30 56.5,30 55.5,31 55.5,35 60.5,35 64,38.5 64.5,38.5 R16.1 | v21.5,21 21,21 19.5,22.5 U2.8
NEG
  Top 0.762: Q2.2 57,94.5 57,97 47,97 C7.- 46.5,97.5 44.5,97.5 44,98 44,100.5 30,100.5 14,116.5 F2.2A
POS
  Top 0.762: C10.+ 47,107.5 54.5,107.5 IC1.1
  Bottom 0.762: F1.2A 33.5,107 46.5,107 C10.+
PREBUFF
  Top 0.406: R4.2 46,34 46,32 R3.1 45.5,32 42,32 | D1.A 38.5,30.5 41.5,30.5 41.5,31.5 C4.1 42,32 | 42,32 42,34 C5.2 41.5,34.5 41.5,35.5 38.5,35.5 D2.C
  Bottom 0.406: U3.12 33.5,33 36,30.5 38,30.5 D1.A
RST  (via drill 0.51)
  Top 0.406: v65.5,82.5 69,82.5 72,79.5 72,64.5 75,61.5 75,16.5 72.5,14 R2.2 | v62.5,83 60.5,85 30.5,85 30.5,81.5 U1.1
  Bottom 0.406: v65.5,82.5 65,83 v62.5,83
RX  (via drill 0.51)
  Top 0.406: v60.5,20 63.5,17 63.5,9.5 66,7 HC05.2 | v61.5,39 66,34.5 66,25.5 65,24.5 R9.1
  Bottom 0.406: v60.5,20 64.5,24 R9.1 | v61.5,39 52.5,39 50,41.5 R8.1
SCK
  Bottom 0.406: U$1.11 60.5,58.5 55,64 55,68 50.5,68 46,63.5 43,63.5 38,58.5 U1.19
TX  (via drill 0.51)
  Top 0.406: v79,53 79,5.5 70,5.5 69,6.5 HC05.3
  Bottom 0.406: v79,53 72.5,59.5 70,59.5 58.5,71 41,71 39,69 38.5,69 U1.23
VCC  (via drill 0.51)
  Top 0.762: 59.5,21.5 64.5,21.5 64.5,19.5 R1.1 65,19 65,15.5 | 59.5,21.5 57.5,21.5 R10.2 | 65,15.5 65,14 R2.1 | 65,15.5 70.75,9.75 | 70.75,9.75 73.5,7 HC05.5 | 77,57 76,56 76,15 70.75,9.75 | IC1.3 60,107.5 60,105.5 66,105.5 C9.+ 66.5,105.5 68.5,107.5 68.5,138.5 77,138.5 POW.1 | U$1.13 61,63.5 61,66 U$1.14 57.75,69.25 | 53.25,73.75 54.5,75 C3.1 | 53.25,73.75 48.5,69 D4.C | 53.25,73.75 57.75,69.25 | D5.C 43.5,69 44.5,70 44.5,78.5 42,81 C12.1 42,81.5 42,83 | 42,83 50,83 51,82 51,79.5 55,79.5 56,80.5 58.5,80.5 POWER.A | D1.C 38,22.5 34.5,22.5 34.5,22 33.5,21 28.5,21 28.5,27 25.5,30 U3.4 25,30 24,29 24,25.5 20,21.5 20,21 18.5,21 17.5,22 17.5,24 11.5,30 U2.4 | 19.25,75.75 18,77 0.23VREF.E | 19.25,75.75 19.5,75.5 19.5,69 18,67.5 2.5VREF.E 18,67 18,66 28.5,66 | 1.25VREF.E 18,87.5 19.5,86 19.5,76 19.25,75.75 | 28.5,66 30,66 U1.7 30.5,66.5 33,69 33,83 42,83 | v29.5,34.5 29,35 29,45 28.5,45.5 28.5,66 | 59.5,21.5 59.5,43.5 57.5,45.5 57.5,69 57.75,69.25
  Bottom 0.762: D4.C 48,68.5 43.5,68.5 D5.C | v29.5,34.5 25.5,30.5 U3.4 | C9.+ 66,105 62,101 62,84.5 58.5,81 POWER.A
VEE  (via drill 0.51)
  Top 0.762: U3.11 33.5,30.5 34.5,31.5 34.5,39.5 38,43 D2.A 38,43.5 35.5,46 35.5,79.5 36,80 v36,81.5 | 64,90 64,90.5 67,93.5 C8.- | 64,90 64,86 | 64,86 64,84 | 64,84 64,82 65,81 65,61 R18.1 | 64,84 77,84 | 64,90 60,94 Q2.3 | 64,86 v36,86
  Bottom 0.762: v36,86 v36,81.5
VIN
  Top 0.406: PROBECON.6 26,10.5 38,10.5 X1.1 38.5,10.5 46,10.5 46,16.5 | C4.2 42,26.5 45.5,26.5 45.5,24.5 R3.2 46,24 46,16.5 | 46,16.5 53.5,9 AUXIN.1
X1  (via drill 0.51)
  Top 0.406: D6.C 43,56 43,60.5 D5.A 43.5,61 48.5,66 53,66 U$1.1 53.5,66 55,64.5 55,48.5 v56,47.5 | 63,35.5 60.5,38 60.5,44.5 v59,46 | 63,35.5 64.5,34 R15.1 | v45,19 45,17.5 16.5,17.5 11.5,22.5 U2.7 | v61,23 63,25 63,35.5
  Bottom 0.406: v59,46 57.5,47.5 v56,47.5 | v45,19 46,20 58,20 v61,23
X10  (via drill 0.51)
  Top 0.406: v59,58 59,49.5 64.5,44 R17.1 | 48.5,59 48.5,60.5 D4.A | 48.5,59 48.5,56 D3.C 48,55.5 42,49.5 42,49 v39.5,46.5 | 48.5,59 53,63.5 U$1.2
  Bottom 0.406: v59,58 54,63 53.5,63 53,63.5 U$1.2 | v39.5,46.5 38.5,46.5 37,45 19.5,45 19.5,38.5 U2.14
~SS
  Bottom 0.406: U$1.8 60.5,50.5 58.5,48.5 51,48.5 49,50.5 38.5,50.5 U1.16

### Text on the board
tPlace: Alick Campbell / ECNG3020 / University of the West Indies, Mona | Spectroscilloscope